# EAGLE design Rex2016 (EAGLE 7.2.0)
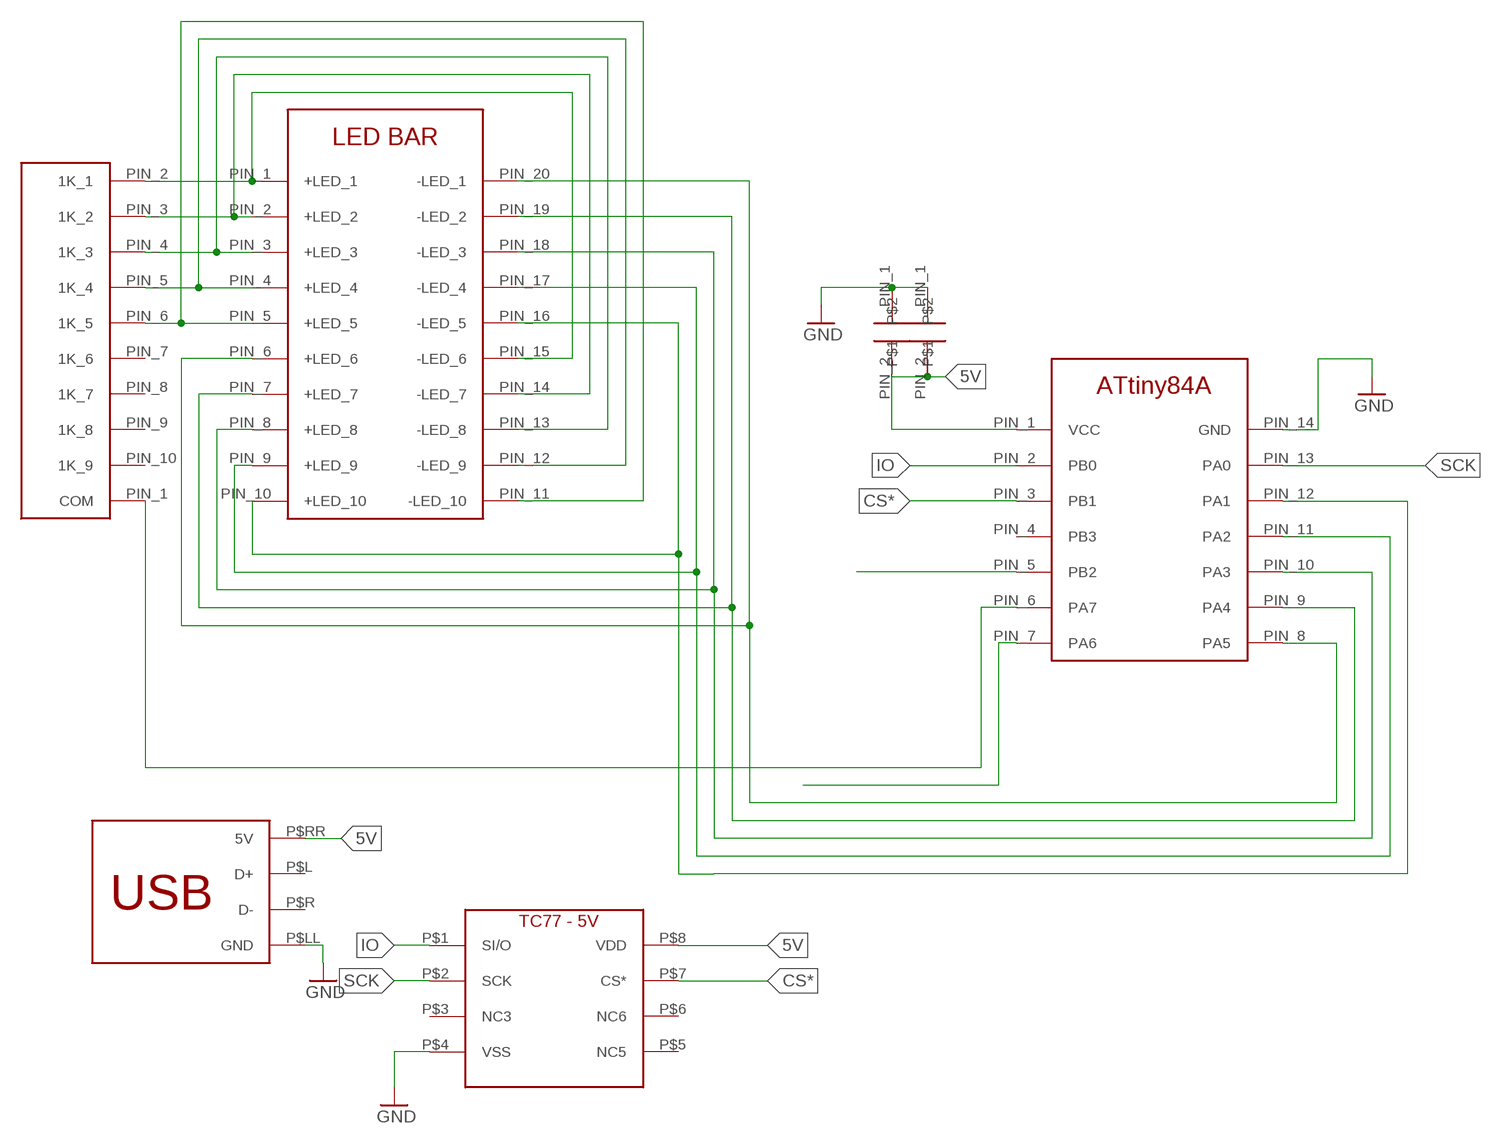
[diagram p0: schematic, sheet 1]

## Parts
U$1  9X_1K_BUSSED_R  [SIP-10]
U$2  10UF_FK18  [CAP_FK18]
U$3  ATTINY84A  [PDIP-14]
U$4  LED_X10_BAR  [LED_X10_BAR]
U$5  TC77  [SOIC-8]
U$6  10UF_FK18  [CAP_FK18]
U$7  USB_A_TH  [USB_A_TH]

## Nets
5V: U$2.PIN_2 U$3.PIN_1(VCC) U$5.P$8(VDD) U$6.PIN_2 U$7.P$RR(5V)
CS*: U$3.PIN_3(PB1) U$5.P$7(CS*)
GND: U$2.PIN_1 U$3.PIN_14(GND) U$5.P$4(VSS) U$6.PIN_1 U$7.P$LL(GND)
IO: U$3.PIN_2(PB0) U$5.P$1(SI/O)
N$1: U$1.PIN_2(1K_1) U$4.PIN_1(+LED_1) U$4.PIN_15(-LED_6)
N$2: U$1.PIN_3(1K_2) U$4.PIN_2(+LED_2) U$4.PIN_14(-LED_7)
N$3: U$1.PIN_4(1K_3) U$4.PIN_3(+LED_3) U$4.PIN_13(-LED_8)
N$4: U$1.PIN_5(1K_4) U$4.PIN_4(+LED_4) U$4.PIN_12(-LED_9)
N$5: U$1.PIN_6(1K_5) U$4.PIN_5(+LED_5) U$4.PIN_11(-LED_10)
N$6: U$3.PIN_12(PA1) U$4.PIN_10(+LED_10) U$4.PIN_16(-LED_5)
N$7: U$3.PIN_11(PA2) U$4.PIN_9(+LED_9) U$4.PIN_17(-LED_4)
N$8: U$3.PIN_10(PA3) U$4.PIN_8(+LED_8) U$4.PIN_18(-LED_3)
N$10: U$3.PIN_5(PB2)
N$16: U$3.PIN_7(PA6)
N$17: U$1.PIN_1(COM) U$3.PIN_6(PA7)
N$18: U$3.PIN_9(PA4) U$4.PIN_7(+LED_7) U$4.PIN_19(-LED_2)
N$19: U$3.PIN_8(PA5) U$4.PIN_6(+LED_6) U$4.PIN_20(-LED_1)
SCK: U$3.PIN_13(PA0) U$5.P$2(SCK)
Unconnected: U$1.PIN_7(1K_6) U$1.PIN_8(1K_7) U$1.PIN_9(1K_8) U$1.PIN_10(1K_9) U$3.PIN_4(PB3) U$5.P$3(NC3) U$5.P$5(NC5) U$5.P$6(NC6) U$7.P$L(D+) U$7.P$R(D-)

## Library data of the parts
U$1 = Next_Make_CPW_2015:9X_1K_BUSSED_R
U$2 U$6 = Next_Make_CPW_2015:10UF_FK18
U$3 = Next_Make_CPW_2015:ATTINY84A
U$4 = Next_Make_CPW_2015:LED_X10_BAR
U$5 = Next_Make_CPW_2016:TC77
U$7 = Next_Make_REX_2016:USB_A_TH

## Board
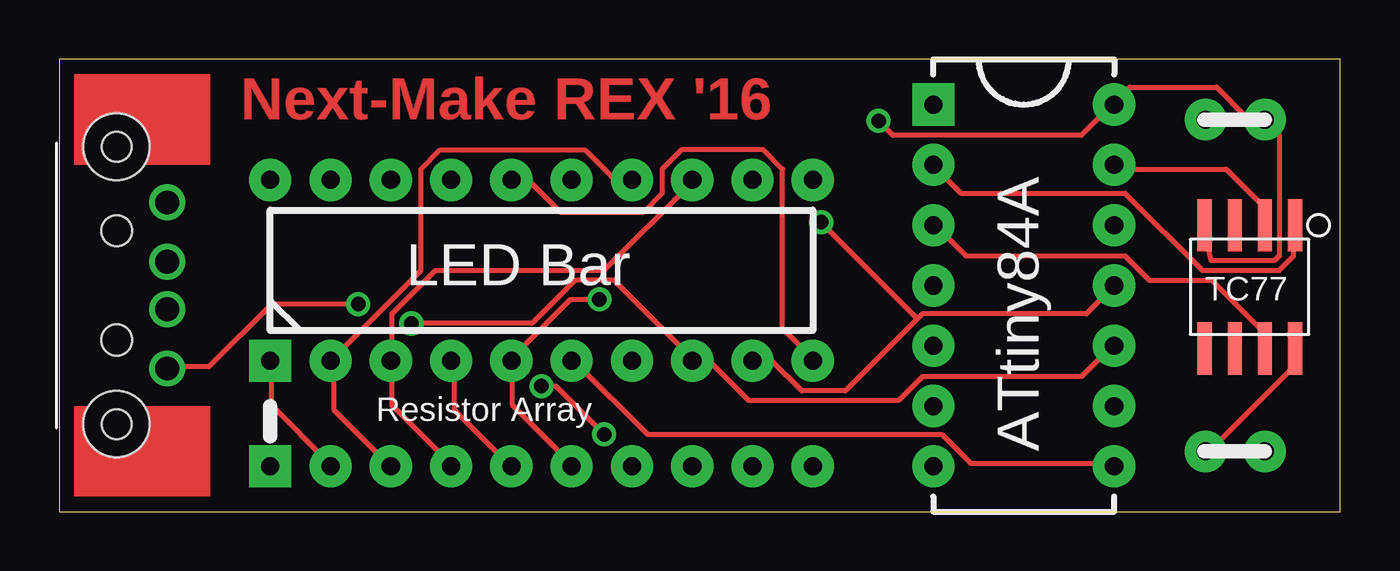
[diagram p1: board, top side]
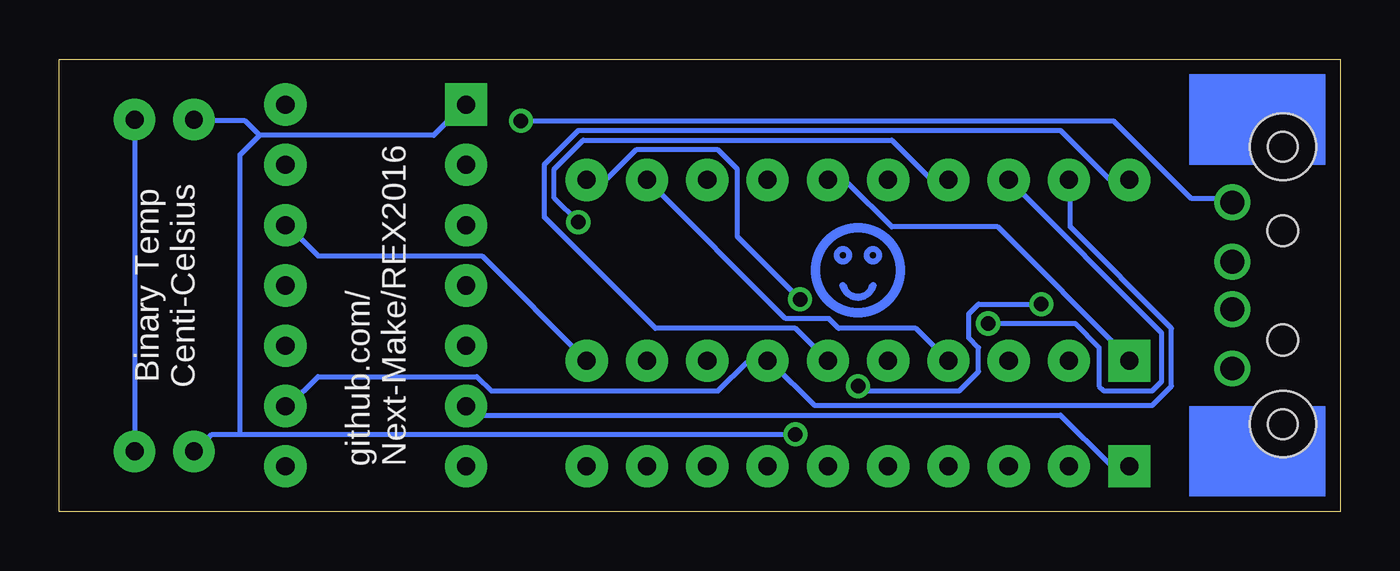
[diagram p2: board, bottom side, seen from below]

Size 53.98 x 19.05 mm. Coordinates in mm from the lower left corner, seen from the top.
Outline: 53.98,19.05 0,19.05 0,0 53.98,0 53.98,19.05
Copper layers (1*16): Top 0.035mm / dielectric 1.5mm / Bottom 0.035mm
Design rules "default *": minimum track width 8mil, minimum drill 24mil, track to track 8mil, track to pad 8mil, pad to pad 8mil, via to via 8mil, smd to smd 8mil, copper to edge 40mil, drill to drill 8mil, minimum pad ring 10mil, minimum via ring 8mil, stop-mask expansion 4mil, vias tented up to drill 25mil, thermal gap 10mil

### Footprints (pad centres in the part's own frame; a part is rotated, then mirrored left to right if it is on the bottom)
SIP-10 = drill 0.762 pad 1.778 square: PIN_1 0,0 | drill 0.762 pad 1.778: PIN_2 0,-2.54; PIN_3 0,-5.08; PIN_4 0,-7.62; PIN_5 0,-10.16; PIN_6 0,-12.7; PIN_7 0,-15.24; PIN_8 0,-17.78; PIN_9 0,-20.32; PIN_10 0,-22.86
CAP_FK18 = drill 0.75 pad 1.75: PIN_1 0,0; PIN_2 2.5,0
PDIP-14 = drill 0.762 pad 1.778 square: PIN_1 0,15.24 | drill 0.762 pad 1.778: PIN_2 0,12.7; PIN_3 0,10.16; PIN_4 0,7.62; PIN_5 0,5.08; PIN_6 0,2.54; PIN_7 0,0; PIN_8 7.62,0; PIN_9 7.62,2.54; PIN_10 7.62,5.08; PIN_11 7.62,7.62; PIN_12 7.62,10.16; PIN_13 7.62,12.7; PIN_14 7.62,15.24
LED_X10_BAR = drill 0.762 pad 1.778 square: PIN_1 0,0 | drill 0.762 pad 1.778: PIN_2 0,-2.54; PIN_3 0,-5.08; PIN_4 0,-7.62; PIN_5 0,-10.16; PIN_6 0,-12.7; PIN_7 0,-15.24; PIN_8 0,-17.78; PIN_9 0,-20.32; PIN_10 0,-22.86; PIN_11 7.62,-22.86; PIN_12 7.62,-20.32; PIN_13 7.62,-17.78; PIN_14 7.62,-15.24; PIN_15 7.62,-12.7; PIN_16 7.62,-10.16; PIN_17 7.62,-7.62; PIN_18 7.62,-5.08; PIN_19 7.62,-2.54; PIN_20 7.62,0
SOIC-8 = smd 2.2 x 0.6: P$1 0,3.81; P$2 0,2.54; P$3 0,1.27; P$4 0,0; P$5 5.2,0; P$6 5.2,1.27; P$7 5.2,2.54; P$8 5.2,3.81
USB_A_TH = drill 1: P$L -1,2.13; P$LL -3.5,2.13; P$R 1,2.13; P$RR 3.5,2.13 | hole 1.3: -2.3,0; 2.3,0 | hole 1.25: -5.85,0; 5.85,0 | hole 2.794: -5.842,0; 5.842,0

### Placement (x,y rotation side)
U$1  8.89,1.91 90 top
U$2  50.8,16.51 180 top
U$3  36.83,1.91 0 top
U$4  8.89,6.35 90 top
U$5  48.26,12.06 270 top
U$6  50.8,2.54 180 top
U$7  2.41,9.53 270 top

### Tracks (layer width: path | path; a pad name or v marks a point on that pad's centre or on a via)
5V  (via drill 0.61)
  Top 0.203: U$5.P$8 52.02,6.71 52.02,6.1 48.36,2.44 U$6.PIN_2 | v12.6,8.74 8.94,8.74 6.3,6.1 4.67,6.1 U$7.P$RR | v20.32,5.28 20.93,5.28 v22.96,3.25
  Bottom 0.203: 45.54,15.85 46.15,16.46 48.16,16.46 U$2.PIN_2 | 45.54,15.85 38.2,15.85 36.98,17.07 U$3.PIN_1 | v12.6,8.74 15.24,8.74 15.65,8.33 15.65,7.32 15.24,6.91 15.24,5.89 16.05,5.08 20.12,5.08 v20.32,5.28 | 46.35,3.25 47.55,3.25 48.16,2.64 U$6.PIN_2 | 46.35,3.25 v22.96,3.25 | 45.54,15.85 46.35,15.04 46.35,3.25
CS*
  Top 0.203: U$5.P$7 50.8,7.52 48.56,9.75 45.92,9.75 44.91,10.77 38.2,10.77 36.98,11.99 U$3.PIN_3
GND  (via drill 0.61)
  Top 0.203: U$5.P$4 48.36,11.99 48.36,11.38 48.54,10.57 51.21,10.57 51.41,10.77 51.41,15.85 50.8,16.46 U$2.PIN_1 50.8,16.66 49.99,16.66 48.77,17.88 45.11,17.88 44.5,17.27 U$3.PIN_14 44.3,17.07 43.08,15.85 35.13,15.85 v34.52,16.46
  Bottom 0.203: U$2.PIN_1 U$6.PIN_1 | v34.52,16.46 9.55,16.46 6.3,13.21 4.67,13.21 U$7.P$LL
IO
  Top 0.203: U$5.P$1 52.02,11.99 52.02,10.77 51.41,10.16 48.16,10.16 44.91,13.41 38,13.41 36.98,14.43 U$3.PIN_2
N$1
  Top 0.203: U$4.PIN_1 8.94,6.3 8.94,4.47 11.38,2.03 U$1.PIN_2
  Bottom 0.203: U$4.PIN_15 21.54,13.82 20.73,13.82 18.9,11.99 14.43,11.99 8.94,6.5 U$4.PIN_1
N$2
  Top 0.203: U$1.PIN_3 13.82,2.03 11.58,4.27 11.58,6.3 U$4.PIN_2 15.24,10.16 15.24,14.43 16.05,15.24 22.15,15.24 23.37,14.02 23.98,14.02 U$4.PIN_14
N$3
  Top 0.203: U$1.PIN_4 16.46,2.03 14.02,4.47 14.02,6.3 U$4.PIN_3 14.02,6.5 14.02,8.33 15.85,10.16 22.96,10.16 26.62,13.82 U$4.PIN_13
N$4
  Top 0.203: U$4.PIN_4 16.66,6.3 16.66,4.27 18.9,2.03 U$1.PIN_5
  Bottom 0.203: U$4.PIN_12 23.37,8.13 21.54,8.13 21.13,7.72 17.88,7.72 U$4.PIN_4
N$5  (via drill 0.61)
  Top 0.203: U$1.PIN_6 21.54,2.03 19.1,4.47 19.1,6.3 U$4.PIN_5 19.1,6.5 21.54,8.94 v22.76,8.94
  Bottom 0.203: v22.76,8.94 25.4,11.58 25.4,14.43 26.21,15.24 29.67,15.24 30.89,14.02 31.7,14.02 U$4.PIN_11
N$6
  Top 0.203: U$4.PIN_16 19.1,13.82 19.91,13.82 21.13,12.6 24.59,12.6 25.4,13.41 25.4,14.43 26.21,15.24 29.67,15.24 30.48,14.43 30.48,7.72 31.7,6.5 U$4.PIN_10
  Bottom 0.203: U$4.PIN_10 36.17,10.77 43.08,10.77 44.3,11.99 U$3.PIN_12
N$7  (via drill 0.61)
  Top 0.203: 36.17,8.13 36.37,8.33 43.28,8.33 44.3,9.35 U$3.PIN_11 | 36.17,8.13 33.12,5.08 31.29,5.08 30.07,6.3 29.26,6.3 U$4.PIN_9 | 36.17,8.13 v32.11,12.19
  Bottom 0.203: v32.11,12.19 33.12,13.21 33.12,14.43 31.9,15.65 18.9,15.65 17.27,14.02 16.66,14.02 U$4.PIN_17
N$8  (via drill 0.61)
  Top 0.203: U$3.PIN_10 44.3,6.91 43.08,5.69 36.37,5.69 35.36,4.67 29.06,4.67 27.43,6.3 26.82,6.3 U$4.PIN_8 26.62,6.5 23.37,9.75 21.74,9.75 19.91,7.92 v14.83,7.92
  Bottom 0.203: U$4.PIN_18 7.52,7.52 7.52,5.49 7.92,5.08 9.96,5.08 10.16,5.28 10.16,6.91 11.18,7.92 v14.83,7.92
N$9
  Bottom 0.305: 20.95,9.53 arc-150 19.68,9.53
N$17
  Bottom 0.203: U$1.PIN_1 8.94,2.03 9.75,2.03 11.79,4.06 36.58,4.06 36.78,4.27 U$3.PIN_6
N$18
  Bottom 0.203: U$3.PIN_9 44.3,4.47 43.08,5.69 36.37,5.69 35.76,5.08 26.21,5.08 24.99,6.3 24.18,6.3 U$4.PIN_7 23.98,6.3 22.15,4.47 7.92,4.47 7.11,5.28 7.11,7.72 11.38,11.99 11.38,13.82 U$4.PIN_19
N$19
  Top 0.203: U$3.PIN_8 44.3,2.03 38.41,2.03 37.19,3.25 24.79,3.25 21.74,6.3 U$4.PIN_6
  Bottom 0.203: U$4.PIN_6 22.96,7.72 28.85,7.72 33.53,12.39 33.53,14.63 32.11,16.05 11.79,16.05 9.75,14.02 8.94,14.02 U$4.PIN_20
SCK
  Top 0.203: U$5.P$2 50.8,12.8 49.17,14.43 44.5,14.43 U$3.PIN_13
(copper drawn outside any net)
  shapes: Bottom area x2, Bottom circle x3, Top area x2

### Text on the board
Top: Next-Make REX '16
tPlace: LED Bar | TC77 | Resistor Array | ATtiny84A
bPlace: Binary Temp / Centi-Celsius | github.com/ / Next-Make/REX2016
tStop: Next-Make REX '16